# Altium schematic sheet Э1.SchDoc: Усилитель
size 420 x 297 mm; =Author: Дорунц Ш.А.; CheckedBy: Семенцов С.Г.; Author: Дорунц Ш.А.; Address1: Address1; Address2: Address2; Address3: Address3; Address4: Address4; DocumentNumber: ИУ4.11.03.03.23.05.09.001 Э1; SheetNumber: 2; SheetTotal: 4; Scale: 1:1; Title2str: низких частот; DocumentType: Схема электрическая структурная; FirstReferrence: ИУ4.11.03.03.23.05.52.09.001; UniversityName: МГТУ им. Н.Э. Баумана; DepartmentName: Кафедра ИУ4; GroupName: Группа ИУ4-52Б
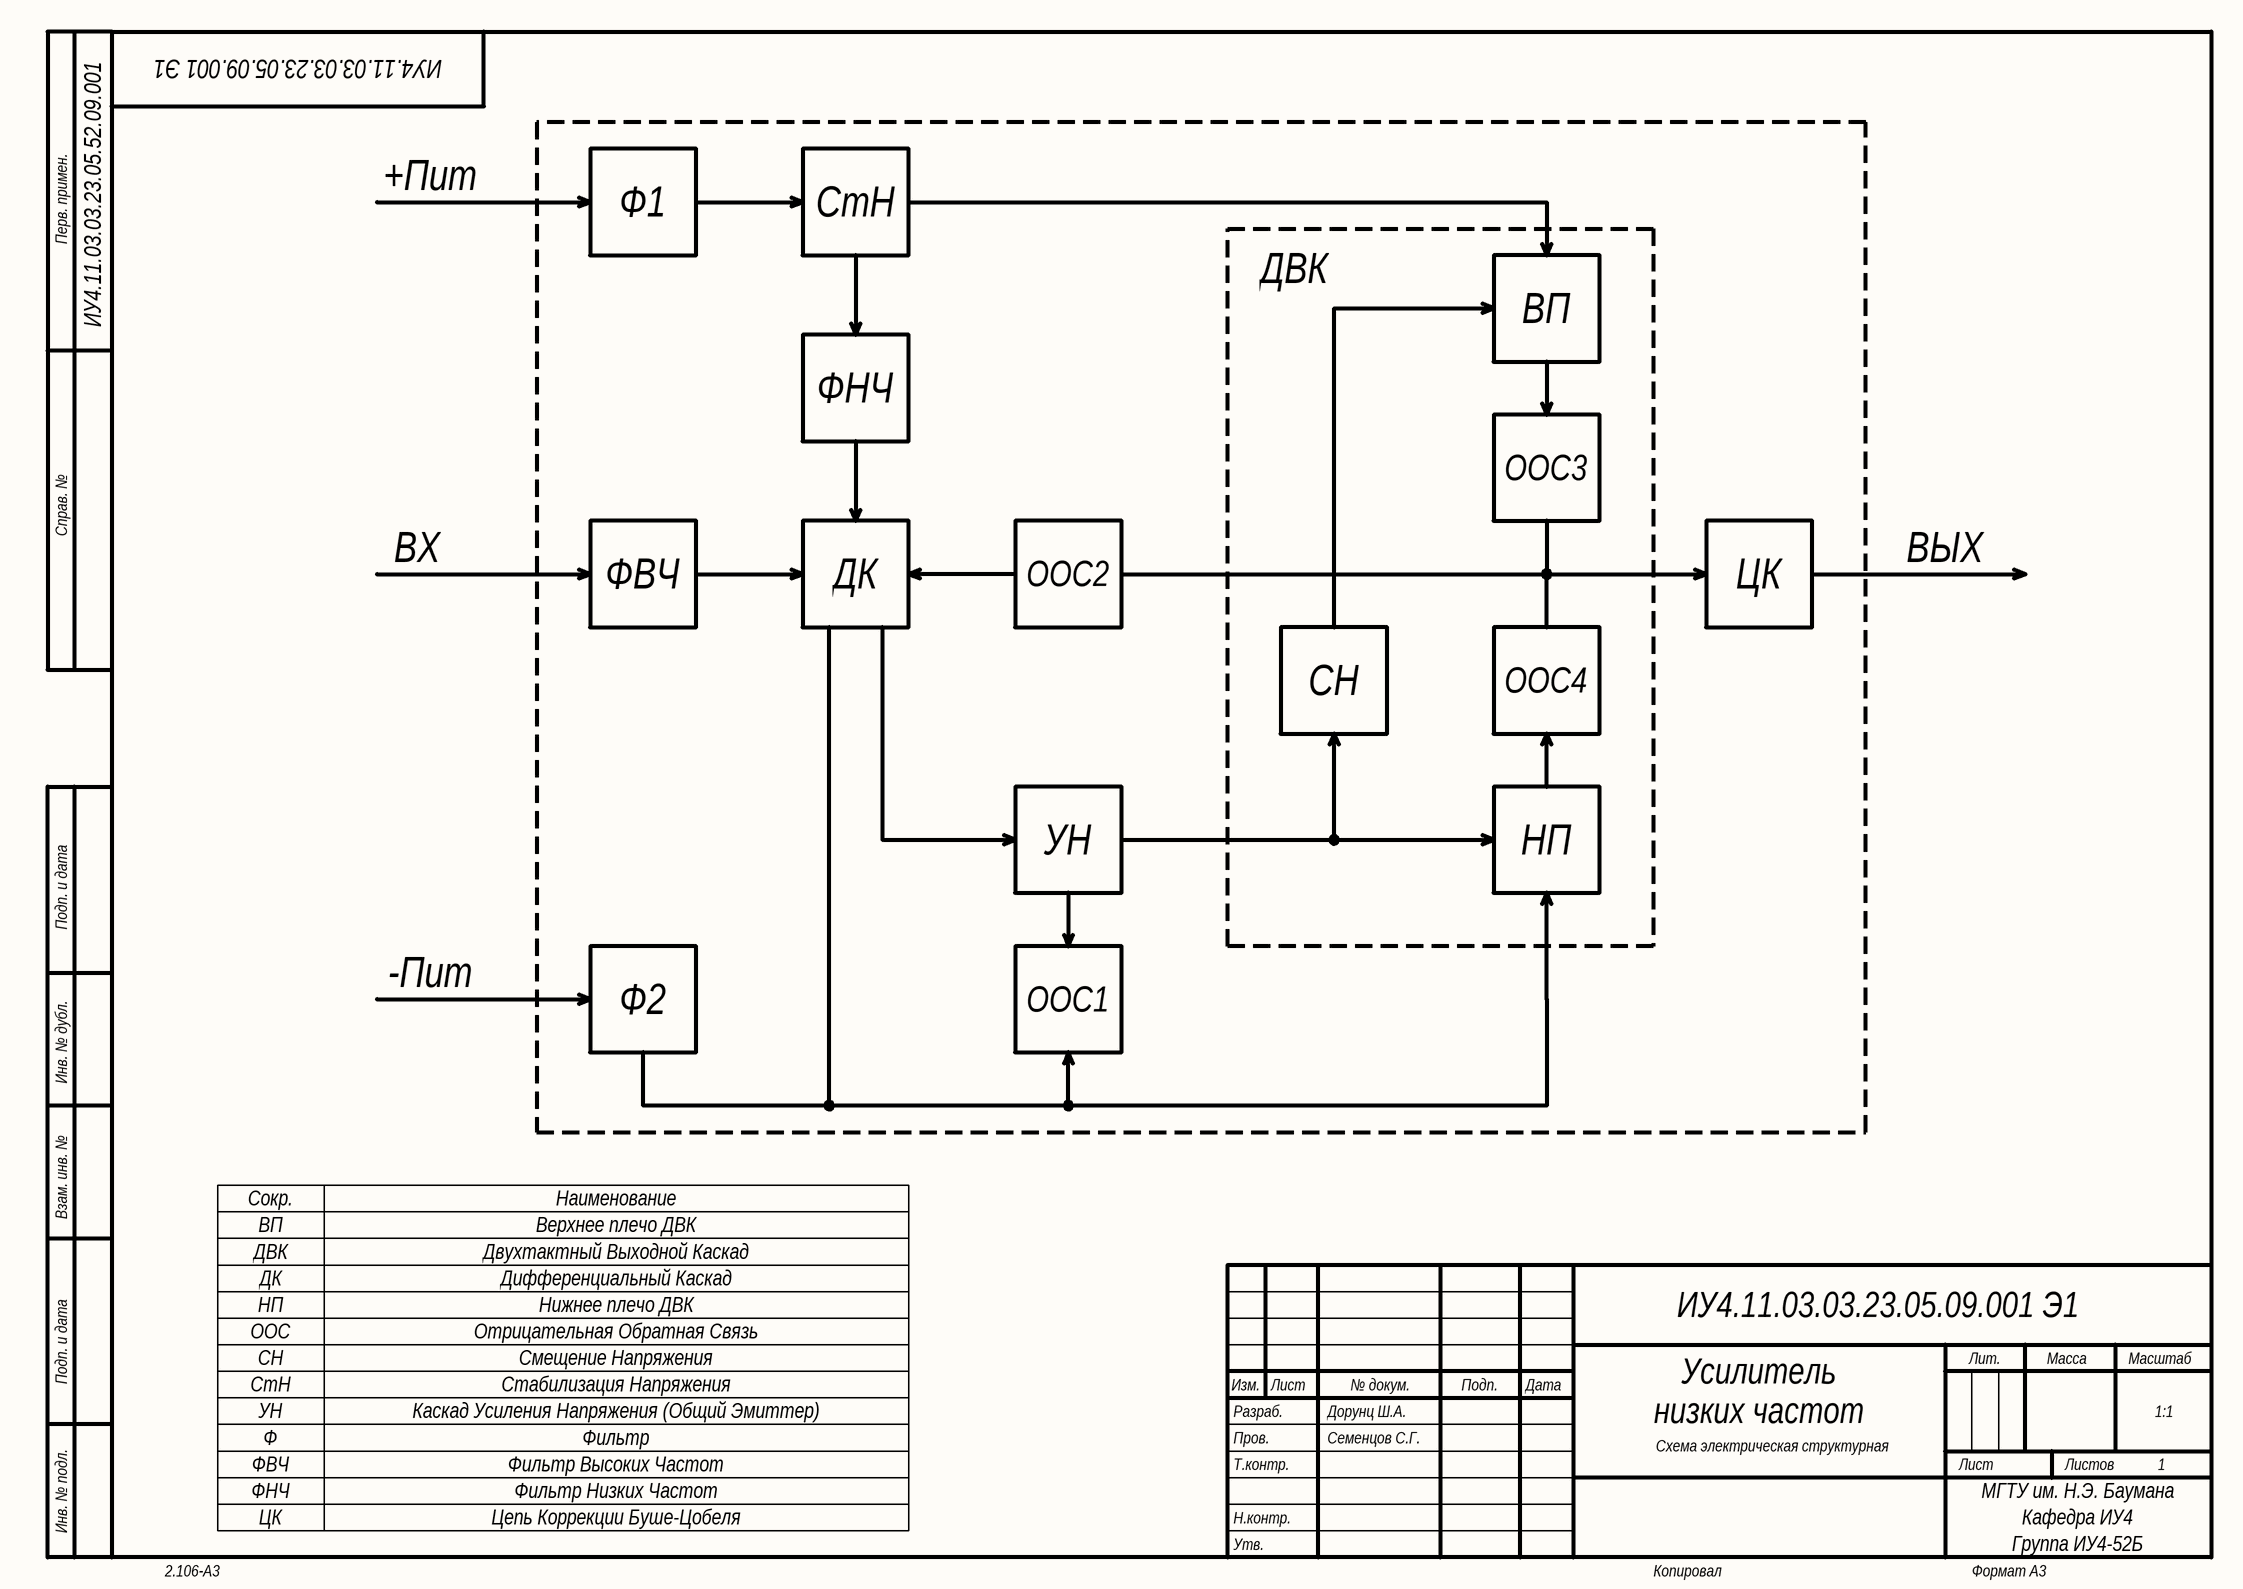
[diagram p0: Э1.SchDoc]

## Notes on the sheet
- +Пит
- Ф1
- СтН
- ДВК
- ВП
- ФНЧ
- ООС3
- ВХ
- ФВЧ
- ДК
- ООС2
- ЦК
- ВЫХ
- СН
- ООС4
- УН
- НП
- -Пит
- Ф2
- ООС1
- Сокр.
- Наименование
- Верхнее плечо ДВК
- Двухтактный Выходной Каскад
- Дифференциальный Каскад
- ООС
- Нижнее плечо ДВК
- Отрицательная Обратная Связь
- Каскад Усиления Напряжения (Общий Эмиттер)
- Смещение Напряжения
- Стабилизация Напряжения
- Ф
- Фильтр
- Фильтр Высоких Частот
- Цепь Коррекции Буше-Цобеля
- Фильтр Низких Частот
- Перв. примен.
- Справ. №
- Подп. и дата
- Инв. № дубл.
- Взам. инв. №
- Разраб.
- Изм.
- Лист
- № докум.
- Подп.
- Дата
- Лит.
- Масса
- Масштаб
- Пров.
- Т.контр.
- Листов
- 1
- Инв. № подл.
- Утв.
- Н.контр.
- 2.106-A3
- Копировал
- Формат А3